# Altium schematic sheet Microcontroller.SchDoc
size A4; SheetNumber: 4; SheetTotal: 5
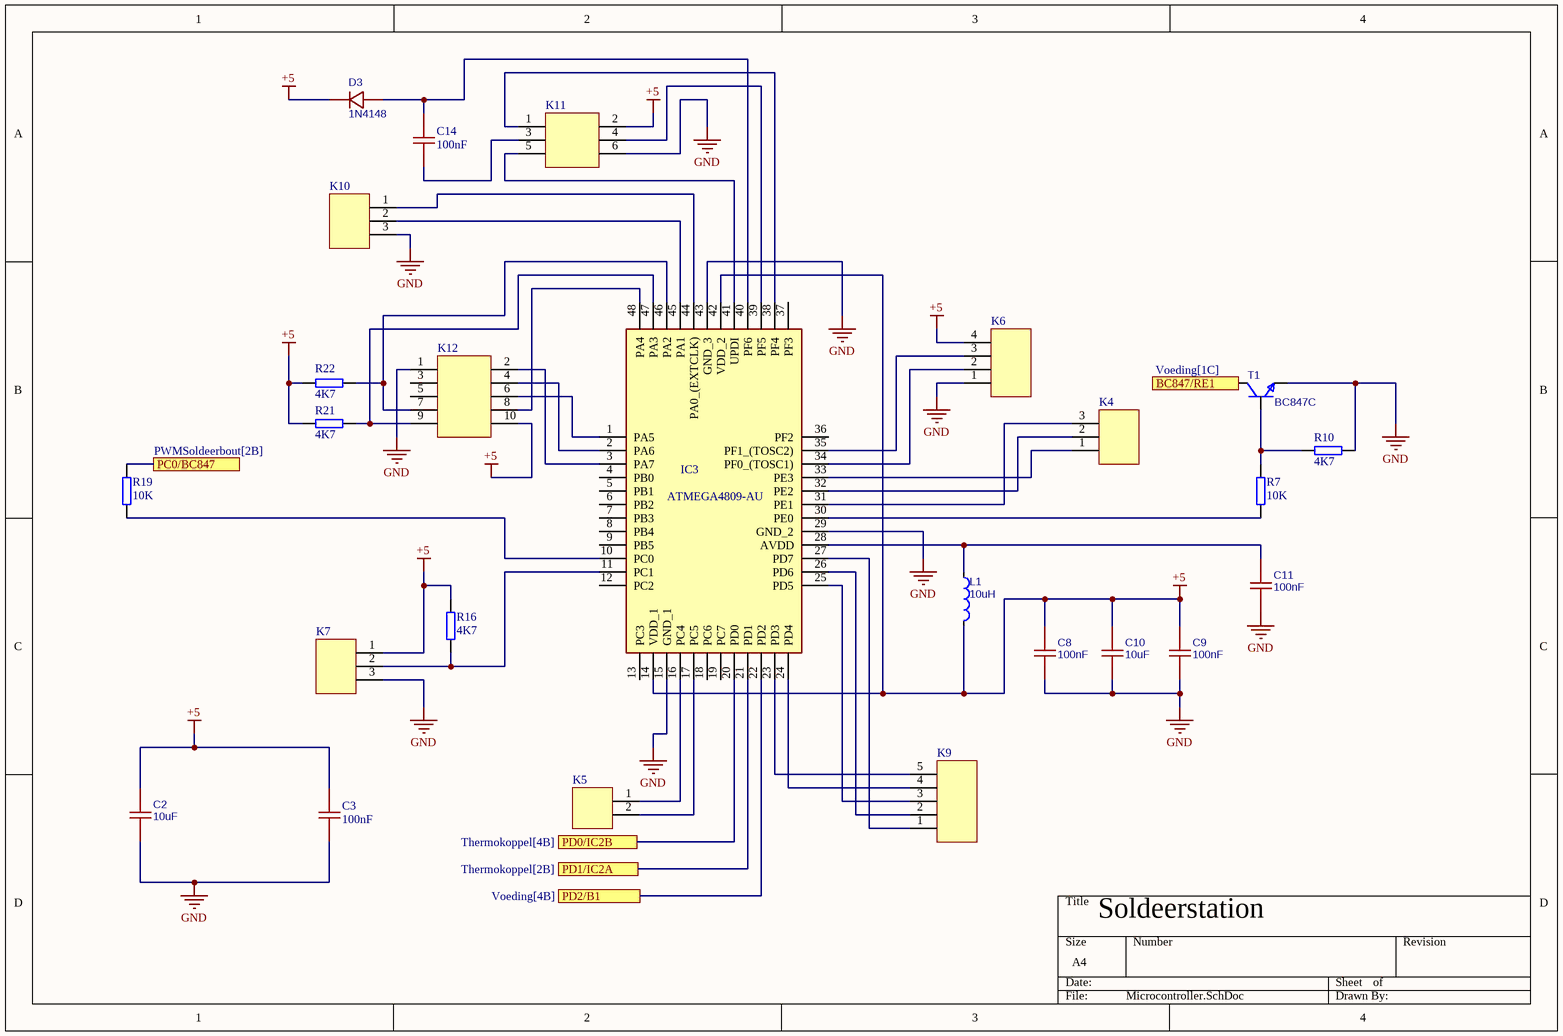
[diagram p0: Microcontroller.SchDoc]

## Parts
C2  10uF  [C2,5,10 10uF]
C3  100nF  [C6,7,12,13 10nF]
C8  100nF  [C6,7,12,13 10nF]
C9  100nF  [C6,7,12,13 10nF]
C10  10uF  [C2,5,10 10uF]
C11  100nF  [C6,7,12,13 10nF]
C14  100nF  [C6,7,12,13 10nF]
D3  1N4148  [D3 1N14148]
IC3  ATMEGA4809-AU  [IC3 ATMEGA4809-AU]
K4  (no value)  [PInHeader_3]
K5  (no value)  [PInHeader_2]
K6  (no value)  [PInHeader_4]
K7  (no value)  [PInHeader_3]
K9  (no value)  [PInHeader_5]
K10  (no value)  [PInHeader_3]
K11  (no value)  [PInHeader_6]
K12  (no value)  [BOxHeader_10]
L1  10uH  [L2 SmoorSpoel]
R7  10K  [RESC2013X50X30ML20T20]
R10  4K7  [RESC2013X50X30ML20T20]
R16  4K7  [RESC2013X50X30ML20T20]
R19  10K  [RESC2013X50X30ML20T20]
R21  4K7  [RESC2013X50X30ML20T20]
R22  4K7  [RESC2013X50X30ML20T20]
T1  BC847C  [T1,2,4 Bipolar Transistors]

## Ports
BC847/RE1 (see Voeding[1C]), PC0/BC847 (see PWMSoldeerbout[2B]), PD0/IC2B (see Thermokoppel[4B]), PD1/IC2A (see Thermokoppel[2B]), PD2/B1 (see Voeding[4B])

## Nets
+5: C2.2 C3.2 C8.1 C9.1 C10.2 D3.1(C) IC3.14(VDD_1) IC3.42(VDD_2) K6.4 K7.1 K11.2 K12.10 L1.2 R16.2 R21.1 R22.1
GND: C2.1 C3.1 C8.2 C9.2 C10.1 C11.2 IC3.15(GND_1) IC3.29(GND_2) IC3.43(GND_3) K6.1 K7.3 K10.3 K11.6 K12.1 R10.2 T1.2(E)
PC0/BC847: R19.2 ; port PC0/BC847
PD0/IC2B: IC3.20(PD0) ; port PD0/IC2B
PD1/IC2A: IC3.21(PD1) ; port PD1/IC2A
PD2/B1: IC3.22(PD2) ; port PD2/B1
NetC11_1: C11.1 IC3.28(AVDD) L1.1
NetC14_1: C14.1 K11.3
NetC14_2: C14.2 D3.2(A) IC3.40(PF6)
NetIC3_1: IC3.1(PA5) K12.6
NetIC3_2: IC3.2(PA6) K12.4
NetIC3_3: IC3.3(PA7) K12.2
NetIC3_10: IC3.10(PC0) R19.1
NetIC3_11: IC3.11(PC1) K7.2 R16.1
NetIC3_16: IC3.16(PC4) K5.1
NetIC3_17: IC3.17(PC5) K5.2
NetIC3_23: IC3.23(PD3) K9.5
NetIC3_24: IC3.24(PD4) K9.4
NetIC3_25: IC3.25(PD5) K9.3
NetIC3_26: IC3.26(PD6) K9.2
NetIC3_27: IC3.27(PD7) K9.1
NetIC3_30: IC3.30(PE0) R7.1
NetIC3_31: IC3.31(PE1) K4.3
NetIC3_32: IC3.32(PE2) K4.2
NetIC3_33: IC3.33(PE3) K4.1
NetIC3_34: IC3.34(PF0_(TOSC1)) K6.2
NetIC3_35: IC3.35(PF1_(TOSC2)) K6.3
NetIC3_38: IC3.38(PF4) K11.1
NetIC3_39: IC3.39(PF5) K11.4
NetIC3_41: IC3.41(UPDI) K11.5
NetIC3_44: IC3.44(PA0_(EXTCLK)) K10.1
NetIC3_45: IC3.45(PA1) K10.2
NetIC3_46: IC3.46(PA2) K12.7 R22.2
NetIC3_47: IC3.47(PA3) K12.9 R21.2
NetIC3_48: IC3.48(PA4) K12.8
NetR7_2: R7.2 R10.1 T1.1(B)

Not connected (* = marked no-connect by the designer): IC3 4(PB0) 5(PB1) 6(PB2) 7(PB3) 8(PB4) 9(PB5) 12(PC2) 13(PC3) 18(PC6) 19(PC7) 36(PF2) 37(PF3); K12 3 5; T1 3(C)

## Notes on the sheet
- Soldeerstation

## Library data of the parts
C2 C10 = C2,5,10 10uF: BOM_Manufacturer: muRata(村田); BOM_Manufacturer Part: GRM21BR61H106KE43L; nameAlias: Capacitance; Contributor: LCSC; BOM_Supplier: LCSC; BOM_Supplier Part: C440198; BOM_JLCPCB Part Class: Basic Part; spicePre: C; spiceSymbolName: GRM21BR61H106KE43L
C3 C14 = C 100nF
C8 C9 C11 = C6,7,12,13 10nF: BOM_Manufacturer: CCTC(三环); BOM_Manufacturer Part: TCC0805X7R103M500DT; nameAlias: Capacitance; Contributor: LCSC; BOM_Supplier: LCSC; BOM_Supplier Part: C376921; BOM_JLCPCB Part Class: Extended Part; spicePre: C; spiceSymbolName: TCC0805X7R103M500DT
D3 = D3 1N14148: 1N4148W-C84367; BOM_Manufacturer: MDD; BOM_Supplier: LCSC; BOM_Manufacturer Part: 1N4148W; BOM_Supplier Part: C84367; BOM_JLCPCB Part Class: Extended Part; spicePre: D; spiceSymbolName: 1N4148W-C84367
IC3 = IC3 ATMEGA4809-AU: 8-bit Microcontrollers - MCU 20MHz, 48KB, TQFP; Manufacturer_Name: Microchip; Geometry.Height: 1.2mm; Mouser Part Number: 556-ATMEGA4809-AU; Mouser Price/Stock: https://www.mouser.co.uk/ProductDetail/Microchip-Technology-Atmel/ATMEGA4809-AU?qs=P1JMDcb91o4zLIorxO9tIg%3D%3D; Manufacturer_Part_Number: ATMEGA4809-AU; Datasheet Link: *
K4 K7 K10 = K PinHeader_3
K5 = K PinHeader_2
K6 = K PinHeader_4
K9 = K PinHeader_5
K11 = K PinHeader_6
K12 = K Boxheader_10
L1 = L2 smoorspoel: BOM_Manufacturer: KOHERelec(科或); BOM_Manufacturer Part: PMI201214S-100M; nameAlias: Inductance; Contributor: LCSC; BOM_Supplier: LCSC; BOM_Supplier Part: C2922559; BOM_JLCPCB Part Class: Extended Part; spicePre: L; spiceSymbolName: PMI201214S-100M
R7 R10 R16 R19 R21 R22 = R Resistor: Manufacturer: Vishay Dale; Part Number: CRCW08050000Z0EA
T1 = T1,2,4 transisitors: BC847C_C3027113; BOM_Manufacturer: SALLTECH(萨瑞); Contributor: lcsc; BOM_Supplier: LCSC; BOM_Supplier Part: C3027113; BOM_Manufacturer Part: BC847C; link: https://atta.szlcsc.com/upload/public/pdf/source/20220824/287706FC7904CA05889B348536529CCD.pdf; BOM_JLCPCB Part Class: Extended Part; spicePre: Q; spiceSymbolName: BC847C_C3027113